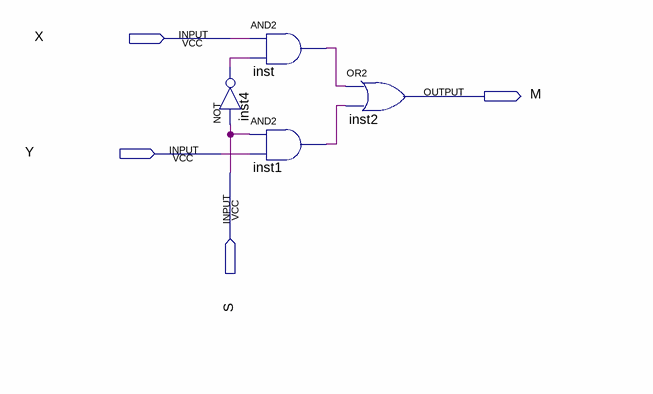
[diagram p0: schematic sheet]
// Quartus schematic Lab3.bdf as structural Verilog: 4 symbols, 4 pins
module Lab3 (
  input  X,
  input  Y,
  input  S,
  output M
);

  wire inst1_out, inst4_out, inst_out;

  not inst4 (inst4_out, S);
  and inst (inst_out, X, inst4_out);
  and inst1 (inst1_out, S, Y);
  or inst2 (M, inst_out, inst1_out);
endmodule
